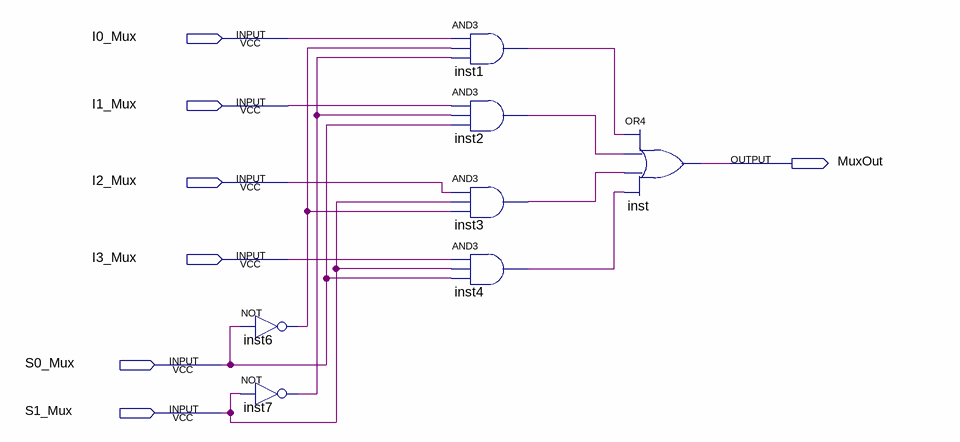
[diagram p0: schematic sheet]
// Quartus schematic Mux4a1.bdf as structural Verilog: 7 symbols, 7 pins
module Mux4a1 (
  input  I0_Mux,
  input  I1_Mux,
  input  I2_Mux,
  input  I3_Mux,
  input  S0_Mux,
  input  S1_Mux,
  output MuxOut
);

  wire inst1_out, inst2_out, inst3_out, inst4_out, inst6_out, inst7_out;

  not inst6 (inst6_out, S0_Mux);
  not inst7 (inst7_out, S1_Mux);
  and inst1 (inst1_out, I0_Mux, inst6_out, inst7_out);
  and inst2 (inst2_out, I1_Mux, inst7_out, S0_Mux);
  and inst3 (inst3_out, I2_Mux, S1_Mux, inst6_out);
  and inst4 (inst4_out, I3_Mux, S1_Mux, S0_Mux);
  or inst (MuxOut, inst1_out, inst2_out, inst3_out, inst4_out);
endmodule
